# EAGLE design csa_viaproto-v1.0a (EAGLE 4.15)
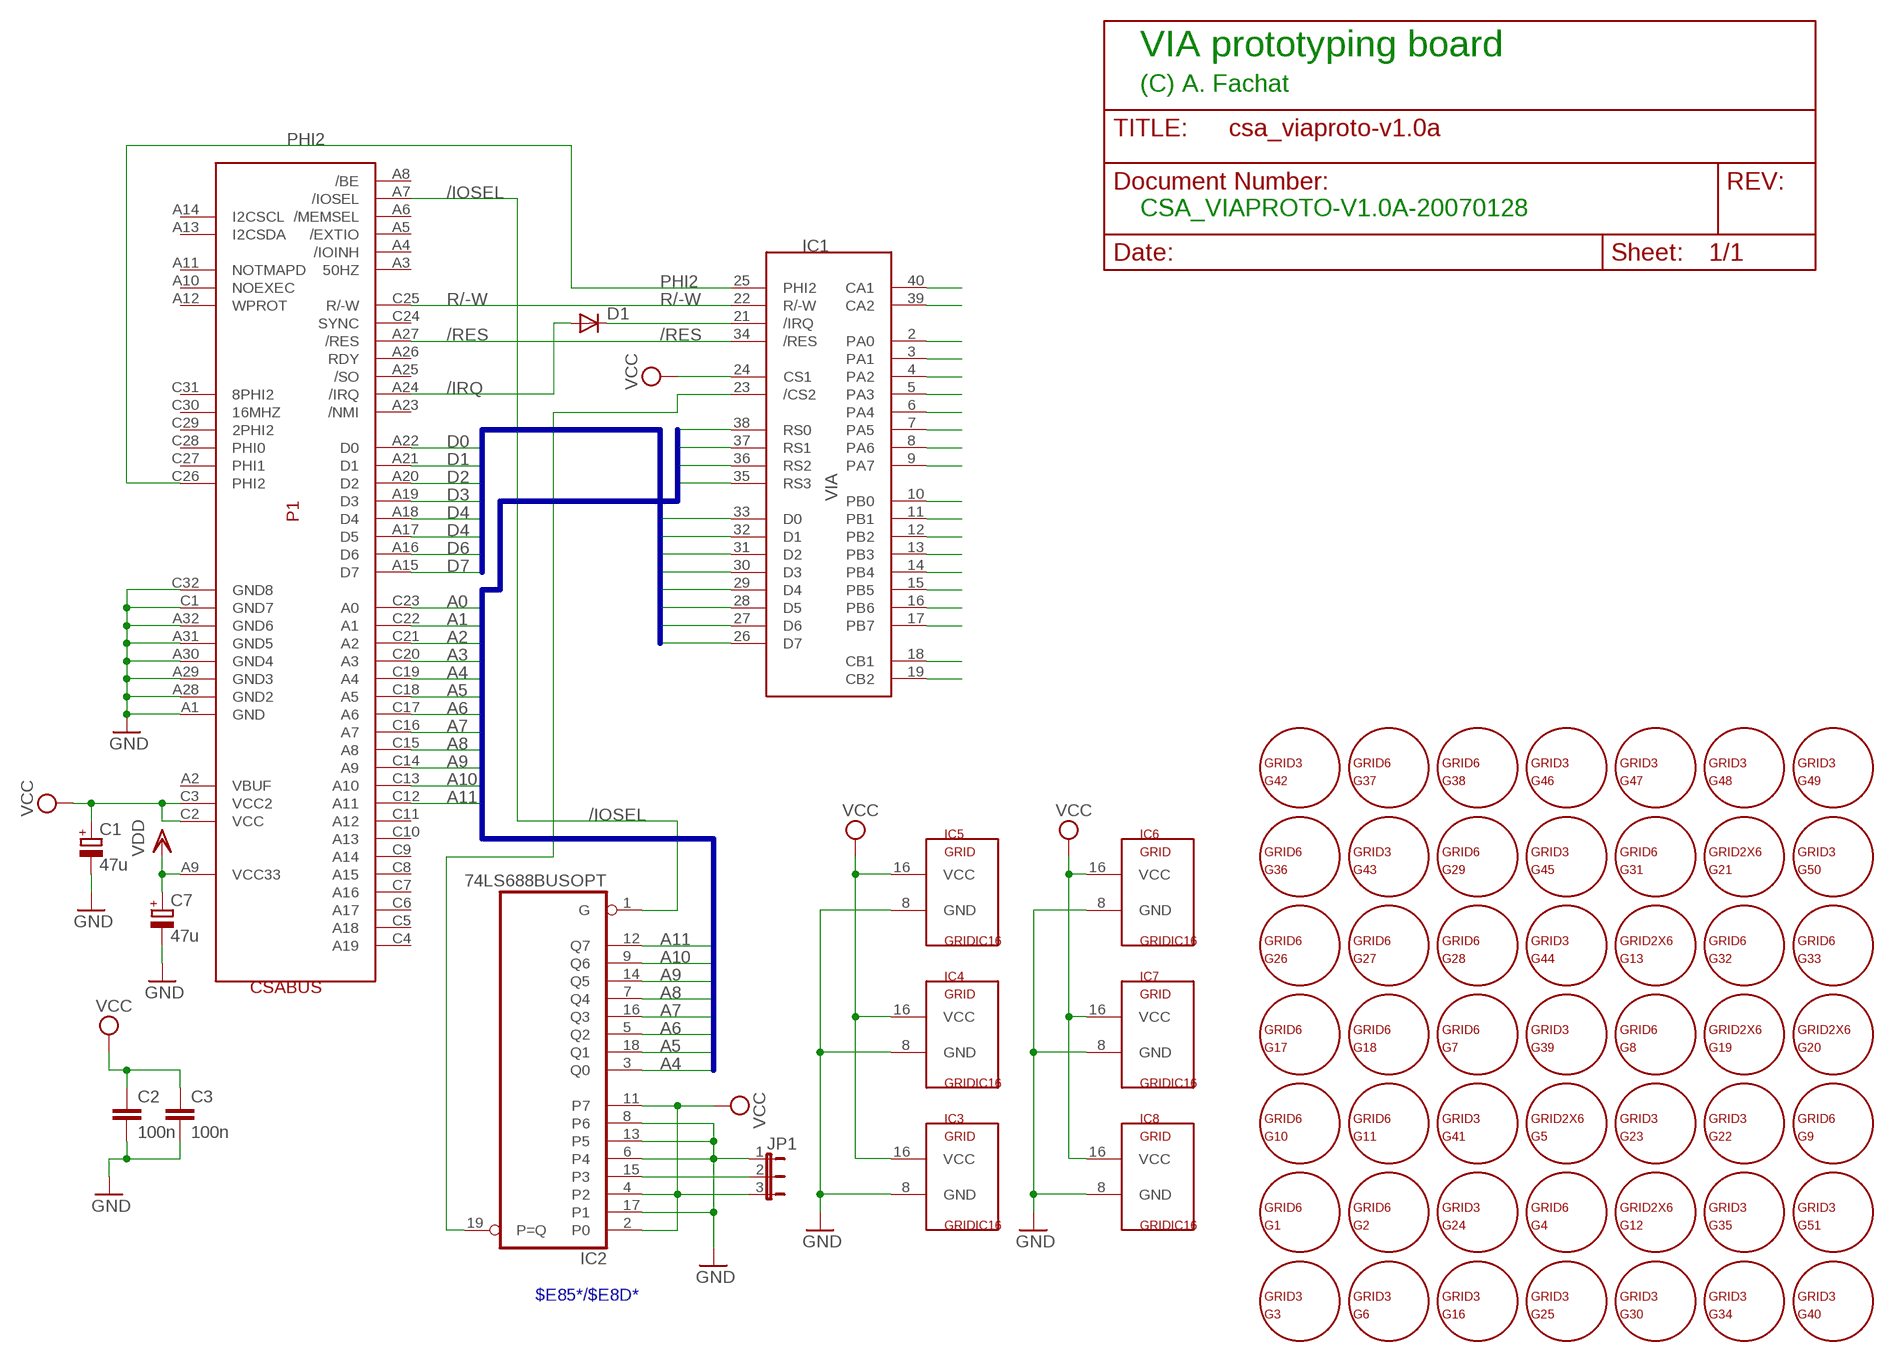
[diagram p0: schematic, sheet 1]

## Parts
C1  47u  CPOL-EUE2.5-5  [E2,5-5]
C2  100n  C-EU050-025X075  [C050-025X075]
C3  100n  C-EU050-025X075  [C050-025X075]
C7  47u  CPOL-EUE2.5-5  [E2,5-5]
D1  DIODE-D-5  [D-5]
G1  GRID6  [GRID6]
G2  GRID6  [GRID6]
G3  GRID3  [GRID3]
G4  GRID6  [GRID6]
G5  GRID2X6  [GRID2X6]
G6  GRID3  [GRID3]
G7  GRID6  [GRID6]
G8  GRID6  [GRID6]
G9  GRID6  [GRID6]
G10  GRID6  [GRID6]
G11  GRID6  [GRID6]
G12  GRID2X6  [GRID2X6]
G13  GRID2X6  [GRID2X6]
G16  GRID3  [GRID3]
G17  GRID6  [GRID6]
G18  GRID6  [GRID6]
G19  GRID2X6  [GRID2X6]
G20  GRID2X6  [GRID2X6]
G21  GRID2X6  [GRID2X6]
G22  GRID3  [GRID3]
G23  GRID3  [GRID3]
G24  GRID3  [GRID3]
G25  GRID3  [GRID3]
G26  GRID6  [GRID6]
G27  GRID6  [GRID6]
G28  GRID6  [GRID6]
G29  GRID6  [GRID6]
G30  GRID3  [GRID3]
G31  GRID6  [GRID6]
G32  GRID6  [GRID6]
G33  GRID6  [GRID6]
G34  GRID3  [GRID3]
G35  GRID3  [GRID3]
G36  GRID6  [GRID6]
G37  GRID6  [GRID6]
G38  GRID6  [GRID6]
G39  GRID3  [GRID3]
G40  GRID3  [GRID3]
G41  GRID3  [GRID3]
G42  GRID3  [GRID3]
G43  GRID3  [GRID3]
G44  GRID3  [GRID3]
G45  GRID3  [GRID3]
G46  GRID3  [GRID3]
G47  GRID3  [GRID3]
G48  GRID3  [GRID3]
G49  GRID3  [GRID3]
G50  GRID3  [GRID3]
G51  GRID3  [GRID3]
IC1  VIA  [DIL40]
IC2  74LS688BUSOPT  [DIL20]
IC3  GRIDIC16  [GRIDIC8]
IC4  GRIDIC16  [GRIDIC8]
IC5  GRIDIC16  [GRIDIC8]
IC6  GRIDIC16  [GRIDIC8]
IC7  GRIDIC16  [GRIDIC8]
IC8  GRIDIC16  [GRIDIC8]
JP1  JP2E  [JP2]
P1  CSABUS  [CSABUS]

## Nets
/IOSEL: IC2.1(G) P1.A7(/IOSEL)
/IRQ: D1.A P1.A24(/IRQ)
/RES: IC1.34(/RES) P1.A27(/RES)
A0: IC1.38(RS0) P1.C23(A0)
A1: IC1.37(RS1) P1.C22(A1)
A2: IC1.36(RS2) P1.C21(A2)
A3: IC1.35(RS3) P1.C20(A3)
A4: IC2.3(Q0) P1.C19(A4)
A5: IC2.18(Q1) P1.C18(A5)
A6: IC2.5(Q2) P1.C17(A6)
A7: IC2.16(Q3) P1.C16(A7)
A8: IC2.7(Q4) P1.C15(A8)
A9: IC2.14(Q5) P1.C14(A9)
A10: IC2.9(Q6) P1.C13(A10)
A11: IC2.12(Q7) P1.C12(A11)
D0: IC1.33(D0) P1.A22(D0)
D1: IC1.32(D1) P1.A21(D1)
D2: IC1.31(D2) P1.A20(D2)
D3: IC1.30(D3) P1.A19(D3)
D4: IC1.29(D4) P1.A17(D5) P1.A18(D4)
D5: IC1.28(D5)
D6: IC1.27(D6) P1.A16(D6)
D7: IC1.26(D7) P1.A15(D7)
GND: C1.- C2.2 C3.2 C7.- IC2.6(P4) IC2.8(P6) IC2.13(P5) IC2.17(P1) IC3.8(GND) IC4.8(GND) IC5.8(GND) IC6.8(GND) IC7.8(GND) IC8.8(GND) JP1.1 P1.A1(GND) P1.A28(GND2) P1.A29(GND3) P1.A30(GND4) P1.A31(GND5) P1.A32(GND6) P1.C1(GND7) P1.C32(GND8)
N$2: D1.C IC1.21(/IRQ)
N$7: IC1.23(/CS2) IC2.19(P=Q)
N$8: IC1.40(CA1)
N$9: IC1.39(CA2)
N$10: IC1.2(PA0)
N$11: IC1.3(PA1)
N$12: IC1.4(PA2)
N$13: IC1.5(PA3)
N$14: IC1.6(PA4)
N$15: IC1.7(PA5)
N$16: IC1.8(PA6)
N$17: IC1.9(PA7)
N$18: IC1.10(PB0)
N$19: IC1.11(PB1)
N$20: IC1.12(PB2)
N$21: IC1.13(PB3)
N$22: IC1.14(PB4)
N$23: IC1.15(PB5)
N$24: IC1.16(PB6)
N$25: IC1.17(PB7)
N$26: IC1.18(CB1)
N$27: IC1.19(CB2)
N$29: IC2.15(P3) JP1.2
PHI2: IC1.25(PHI2) P1.C26(PHI2)
R/-W: IC1.22(R/-W) P1.C25(R/-W)
VCC: C1.+ C2.1 C3.1 IC1.24(CS1) IC2.2(P0) IC2.4(P2) IC2.11(P7) IC3.16(VCC) IC4.16(VCC) IC5.16(VCC) IC6.16(VCC) IC7.16(VCC) IC8.16(VCC) JP1.3 P1.C2(VCC) P1.C3(VCC2)
VDD: C7.+ P1.A9(VCC33)
Unconnected: P1.A2(VBUF) P1.A3(50HZ) P1.A4(/IOINH) P1.A5(/EXTIO) P1.A6(/MEMSEL) P1.A8(/BE) P1.A10(NOEXEC) P1.A11(NOTMAPD) P1.A12(WPROT) P1.A13(I2CSDA) P1.A14(I2CSCL) P1.A23(/NMI) P1.A25(/SO) P1.A26(RDY) P1.C4(A19) P1.C5(A18) P1.C6(A17) P1.C7(A16) P1.C8(A15) P1.C9(A14) P1.C10(A13) P1.C11(A12) P1.C24(SYNC) P1.C27(PHI1) P1.C28(PHI0) P1.C29(2PHI2) P1.C30(16MHZ) P1.C31(8PHI2)

## Buses
D[0..7]
A[0..11]

## Notes on the sheet
- VIA prototyping board
- (C) A. Fachat
- CSA_VIAPROTO-V1.0A-20070128
- $E85*/$E8D*

## Power pins joined to a net without a drawn wire
GND: IC1.1(GND) IC2.10(GND)
VCC: IC1.20(VCC) IC2.20(VCC)

## Library data of the parts
C1 C7 = rcl:CPOL-EU: POLARIZED CAPACITOR, European symbol
C2 C3 = rcl:C-EU: CAPACITOR, European symbol
D1 = diode:DIODE-: DIODE
G1-G13 G16-G51 = csa:GRID
IC1 = csa:VIA
IC2 = csa:74LS688BUSOPT
IC3-IC8 = csa:GRIDIC
JP1 = jumper:JP2E: JUMPER
P1 = csa:CSABUS

## Board
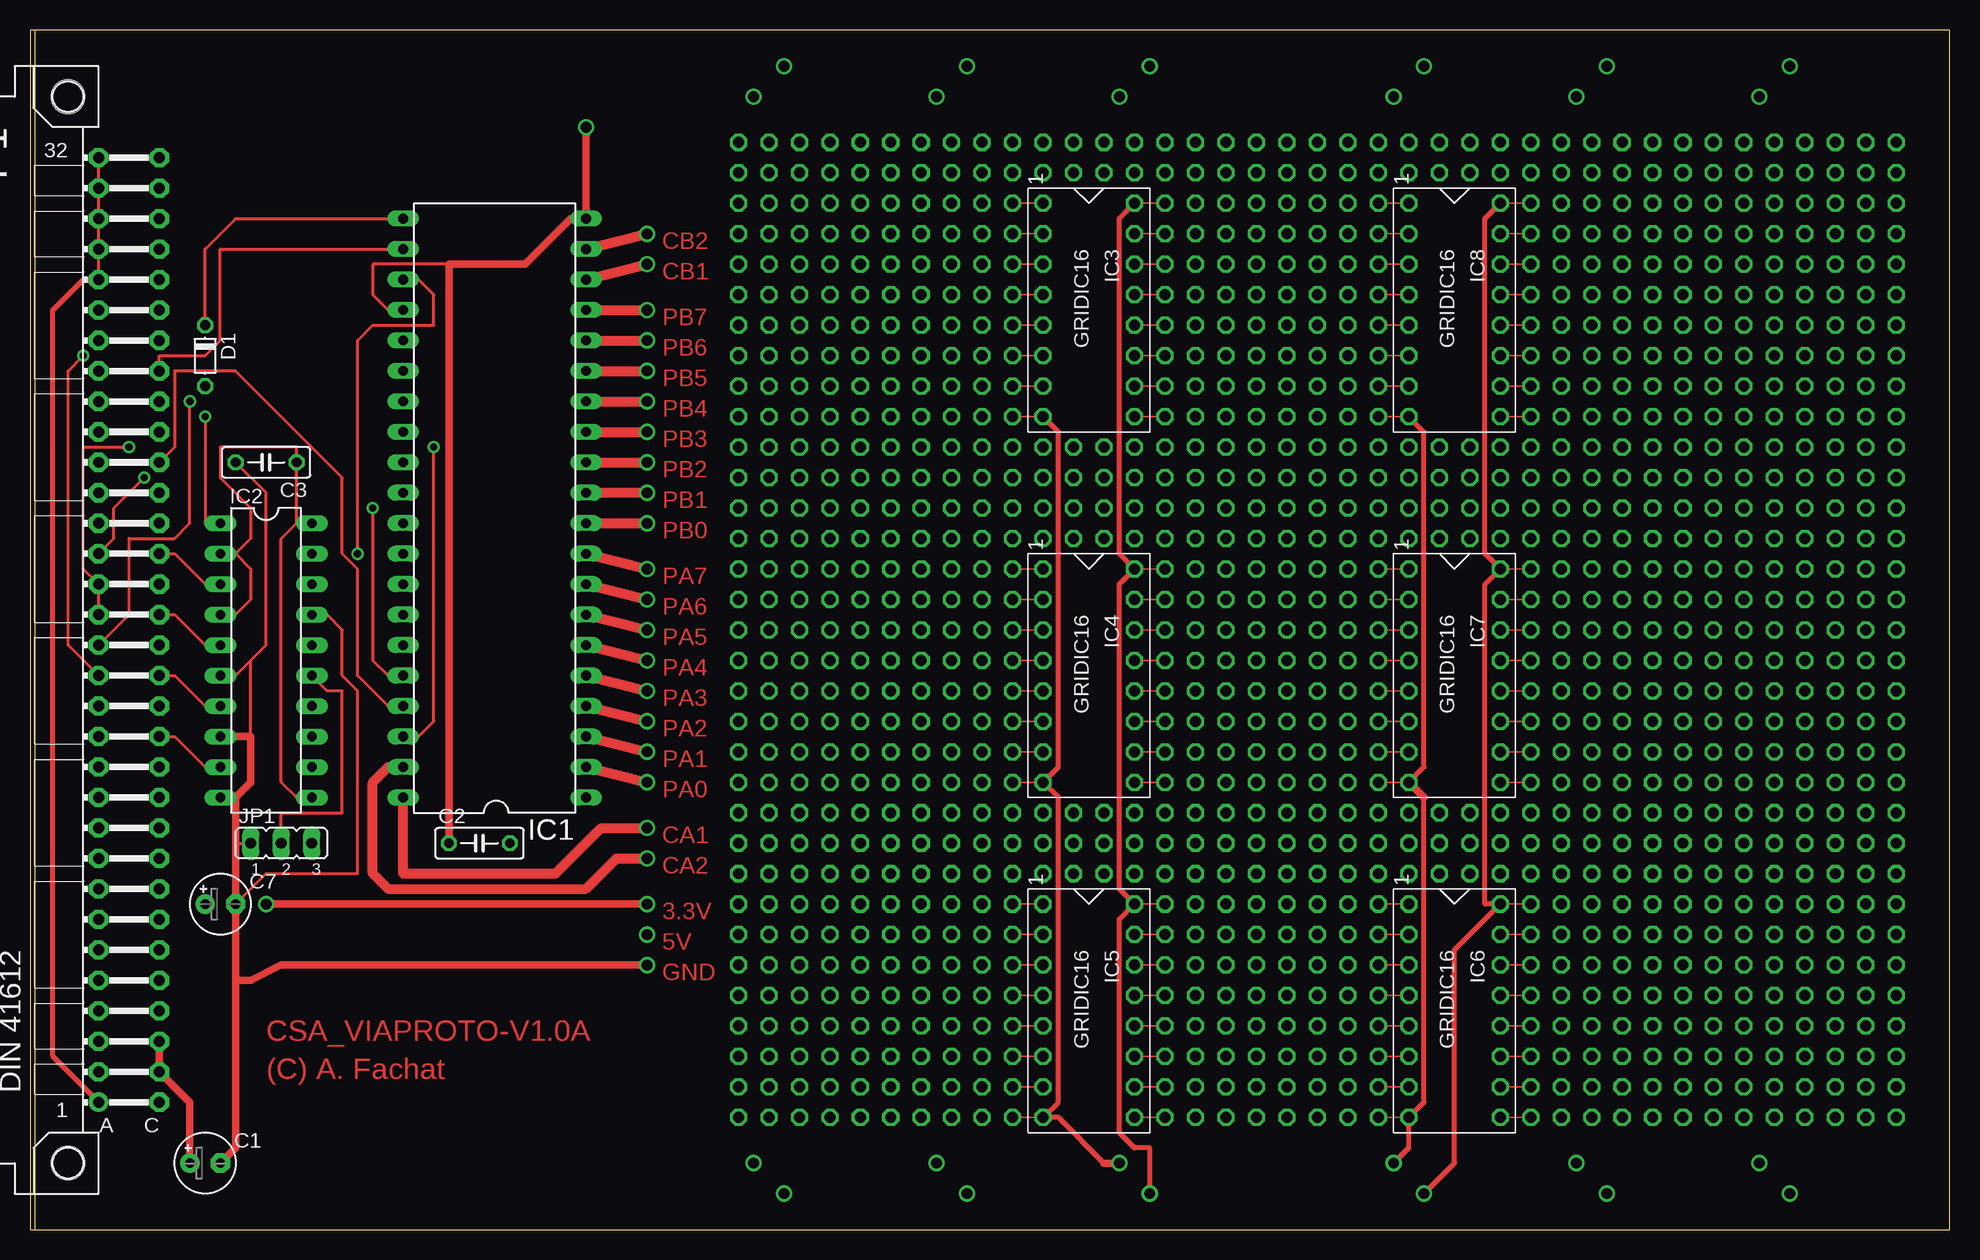
[diagram p1: board, top side]
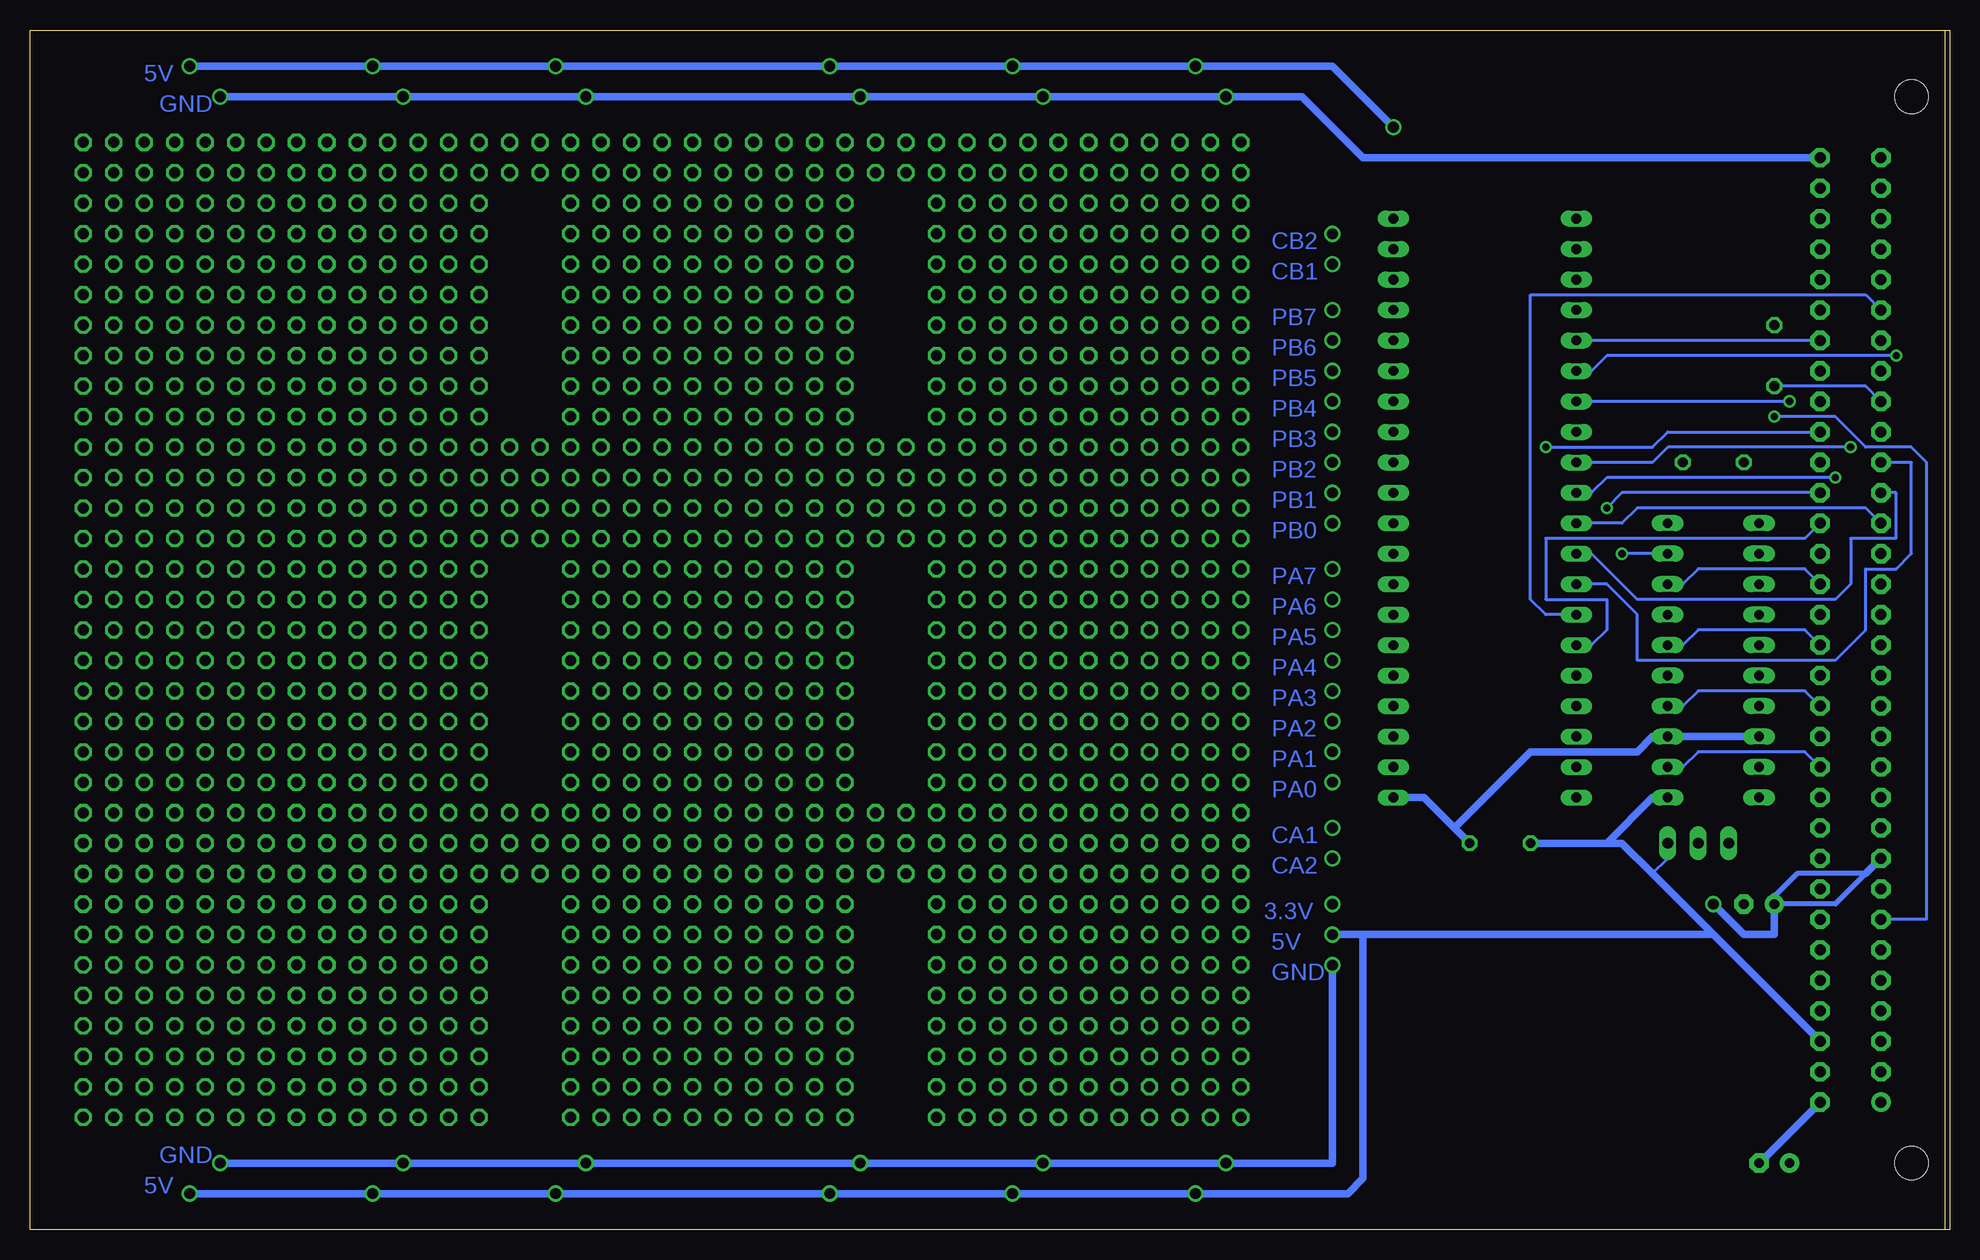
[diagram p2: board, bottom side, seen from below]

Size 160 x 100.03 mm. Coordinates in mm from the lower left corner, seen from the top.
Outline: 0,0.01 160,0.01 160,100.01 0,100.01 0,0.01
Copper layers (1*16): Top 0.035mm / dielectric 1.5mm / Bottom 0.035mm
Design rules "default": minimum track width 10mil, minimum drill 24mil, track to track 8mil, track to pad 8mil, pad to pad 8mil, via to via 8mil, smd to smd 8mil, copper to edge 40mil, drill to drill 8mil, minimum pad ring 10mil, minimum via ring 8mil, stop-mask expansion 4mil, vias tented up to drill 0mil, thermal gap 10mil

### Footprints (pad centres in the part's own frame; a part is rotated, then mirrored left to right if it is on the bottom)
E2,5-5 = drill 0.813 pad 1.6 round: + -1.27,0 | drill 0.813 pad 1.6 octagon: - 1.27,0
C050-025X075 = drill 0.813 octagon: 1 -2.54,0; 2 2.54,0
D-5 = drill 0.813 octagon: A 2.54,0; C -2.54,0
GRID6 = drill 0.914 octagon: 1 -6.35,-1.27; 2 -3.81,-1.27; 3 -1.27,-1.27; 4 1.27,-1.27; 5 3.81,-1.27; 6 6.35,-1.27; 7 -6.35,3.81; 8 -3.81,3.81; 9 -1.27,3.81; 10 1.27,3.81; 11 3.81,3.81; 12 6.35,3.81; 13 -6.35,-6.35; 14 -3.81,-6.35; 15 -1.27,-6.35; 16 1.27,-6.35; 17 3.81,-6.35; 18 6.35,-6.35; A -6.35,1.27; A1 -6.35,6.35; A2 -6.35,-3.81; B -3.81,1.27; B1 -3.81,6.35; B2 -3.81,-3.81; C -1.27,1.27; C1 -1.27,6.35; C2 -1.27,-3.81; D 1.27,1.27; D1 1.27,6.35; D2 1.27,-3.81; E 3.81,1.27; E1 3.81,6.35; E2 3.81,-3.81; F 6.35,1.27; F1 6.35,6.35; F2 6.35,-3.81
GRID3 = drill 0.914 octagon: 1 -2.54,2.54; 2 0,2.54; 3 2.54,2.54; 13 -2.54,-2.54; 14 0,-2.54; 15 2.54,-2.54; A2 -2.54,0; B2 0,0; C2 2.54,0
GRID2X6 = drill 0.914 octagon: 1 -1.27,-1.27; 2 1.27,-1.27; 3 -1.27,1.27; 7 -1.27,3.81; 8 1.27,3.81; 13 -1.27,-6.35; 14 1.27,-6.35; 15 1.27,1.27; A1 -1.27,6.35; A2 -1.27,-3.81; B1 1.27,6.35; B2 1.27,-3.81
DIL40 = drill 0.813 long: 1 -16.51,-7.62; 2 -13.97,-7.62; 3 -11.43,-7.62; 4 -8.89,-7.62; 5 -6.35,-7.62; 6 -3.81,-7.62; 7 -1.27,-7.62; 8 1.27,-7.62; 9 3.81,-7.62; 10 6.35,-7.62; 11 8.89,-7.62; 12 11.43,-7.62; 13 13.97,-7.62; 14 16.51,-7.62; 15 19.05,-7.62; 16 21.59,-7.62; 17 24.13,-7.62; 18 26.67,-7.62; 19 29.21,-7.62; 20 31.75,-7.62; 21 31.75,7.62; 22 29.21,7.62; 23 26.67,7.62; 24 24.13,7.62; 25 21.59,7.62; 26 19.05,7.62; 27 16.51,7.62; 28 13.97,7.62; 29 11.43,7.62; 30 8.89,7.62; 31 6.35,7.62; 32 3.81,7.62; 33 1.27,7.62; 34 -1.27,7.62; 35 -3.81,7.62; 36 -6.35,7.62; 37 -8.89,7.62; 38 -11.43,7.62; 39 -13.97,7.62; 40 -16.51,7.62
DIL20 = drill 0.813 long: 1 -10.16,-3.81; 2 -7.62,-3.81; 3 -5.08,-3.81; 4 -2.54,-3.81; 5 0,-3.81; 6 2.54,-3.81; 7 5.08,-3.81; 8 7.62,-3.81; 9 10.16,-3.81; 10 12.7,-3.81; 11 12.7,3.81; 12 10.16,3.81; 13 7.62,3.81; 14 5.08,3.81; 15 2.54,3.81; 16 0,3.81; 17 -2.54,3.81; 18 -5.08,3.81; 19 -7.62,3.81; 20 -10.16,3.81
GRIDIC8 = drill 0.914 octagon: 1 -8.89,-3.81; 2 -6.35,-3.81; 3 -3.81,-3.81; 4 -1.27,-3.81; 5 1.27,-3.81; 6 3.81,-3.81; 7 6.35,-3.81; 8 8.89,-3.81; 9 8.89,3.81; 10 6.35,3.81; 11 3.81,3.81; 12 1.27,3.81; 13 -1.27,3.81; 14 -3.81,3.81; 15 -6.35,3.81; 16 -8.89,3.81; X1 -8.89,-6.35; X2 -6.35,-6.35; X3 -3.81,-6.35; X4 -1.27,-6.35; X5 1.27,-6.35; X6 3.81,-6.35; X7 6.35,-6.35; X8 8.89,-6.35; X9 8.89,6.35; X10 6.35,6.35; X11 3.81,6.35; X12 1.27,6.35; X13 -1.27,6.35; X14 -3.81,6.35; X15 -6.35,6.35; X16 -8.89,6.35
JP2 = drill 0.914 long: 1 -2.54,0; 2 0,0; 3 2.54,0
CSABUS = drill 0.914 pad 1.6 round: A1 7.62,36.83 | drill 0.914 pad 1.6 octagon: A2 7.62,34.29; A3 7.62,31.75; A4 7.62,29.21; A5 7.62,26.67; A6 7.62,24.13; A7 7.62,21.59; A8 7.62,19.05; A9 7.62,16.51; A10 7.62,13.97; A11 7.62,11.43; A12 7.62,8.89; A13 7.62,6.35; A14 7.62,3.81; A15 7.62,1.27; A16 7.62,-1.27; A17 7.62,-3.81; A18 7.62,-6.35; A19 7.62,-8.89; A20 7.62,-11.43; A21 7.62,-13.97; A22 7.62,-16.51; A23 7.62,-19.05; A24 7.62,-21.59; A25 7.62,-24.13; A26 7.62,-26.67; A27 7.62,-29.21; A28 7.62,-31.75; A29 7.62,-34.29; A30 7.62,-36.83; A31 7.62,-39.37; A32 7.62,-41.91; C1 2.54,36.83; C2 2.54,34.29; C3 2.54,31.75; C4 2.54,29.21; C5 2.54,26.67; C6 2.54,24.13; C7 2.54,21.59; C8 2.54,19.05; C9 2.54,16.51; C10 2.54,13.97; C11 2.54,11.43; C12 2.54,8.89; C13 2.54,6.35; C14 2.54,3.81; C15 2.54,1.27; C16 2.54,-1.27; C17 2.54,-3.81; C18 2.54,-6.35; C19 2.54,-8.89; C20 2.54,-11.43; C21 2.54,-13.97; C22 2.54,-16.51; C23 2.54,-19.05; C24 2.54,-21.59; C25 2.54,-24.13; C26 2.54,-26.67; C27 2.54,-29.21; C28 2.54,-31.75; C29 2.54,-34.29; C30 2.54,-36.83; C31 2.54,-39.37; C32 2.54,-41.91 | hole 2.794: 10.16,41.91; 10.16,-46.99

### Placement (x,y rotation side)
C1  14.6,5.56 0 top
C2  37.46,32.23 0 top
C3  19.68,63.98 180 top
C7  15.87,27.15 0 top
D1  14.6,72.87 270 top
G1  149.22,38.58 0 top
G2  133.98,69.06 0 top
G3  153.03,11.91 0 top
G4  149.22,53.82 0 top
G5  118.74,58.9 90 top
G6  145.41,11.91 0 top
G7  133.98,23.34 0 top
G8  133.98,38.58 0 top
G9  133.98,53.82 0 top
G10  133.98,84.3 0 top
G11  149.22,69.06 0 top
G12  118.74,63.98 90 top
G13  118.74,89.38 90 top
G16  137.79,11.91 0 top
G17  149.22,23.34 0 top
G18  149.22,84.3 0 top
G19  88.26,58.9 270 top
G20  88.26,63.98 90 top
G21  88.26,89.38 90 top
G22  92.07,32.23 0 top
G23  84.45,32.23 0 top
G24  130.17,11.91 0 top
G25  122.55,32.23 0 top
G26  103.5,84.3 0 top
G27  103.5,53.82 0 top
G28  103.5,38.58 0 top
G29  103.5,23.34 0 top
G30  114.93,32.23 0 top
G31  103.5,69.06 0 top
G32  73.02,69.06 0 top
G33  73.02,38.58 0 top
G34  107.31,11.91 0 top
G35  99.69,11.91 0 top
G36  73.02,84.3 0 top
G37  73.02,53.82 0 top
G38  73.02,23.34 0 top
G39  76.83,11.91 0 top
G40  69.21,11.91 0 top
G41  61.59,88.11 0 top
G42  61.59,80.49 0 top
G43  61.59,72.87 0 top
G44  61.59,65.25 0 top
G45  61.59,57.63 0 top
G46  61.59,50.01 0 top
G47  61.59,42.39 0 top
G48  61.59,34.77 0 top
G49  61.59,27.15 0 top
G50  61.59,19.53 0 top
G51  61.59,11.91 0 top
IC1  38.73,52.55 90 top
IC2  19.68,48.74 270 top
IC3  88.26,76.68 270 top
IC4  88.26,46.2 270 top
IC5  88.26,18.26 270 top
IC6  118.74,18.26 270 top
IC7  118.74,46.2 270 top
IC8  118.74,76.68 270 top
JP1  20.95,32.23 0 top
P1  13.33,47.47 180 top

### Tracks (layer width: path | path; a pad name or v marks a point on that pad's centre or on a via)
/IOSEL  (via drill 0.61)
  Top 0.254: v14.6,67.79 14.6,58.9 IC2.1
  Bottom 0.254: v14.6,67.79 9.52,67.79 6.98,65.25 3.17,65.25 1.9,63.98 1.9,25.88 P1.A7
/IRQ
  Bottom 0.254: D1.A 6.98,70.33 P1.A24
/RES
  Bottom 0.254: P1.A27 6.98,77.95 34.92,77.95 34.92,52.55 33.65,51.28 IC1.34
A0  (via drill 0.61)
  Top 0.254: v33.65,65.25 33.65,42.39 32.38,41.12 IC1.38
  Bottom 0.254: v33.65,65.25 24.76,65.25 23.49,66.52 P1.C23
A1
  Top 0.254: P1.C22 12.06,65.25 12.06,71.6 17.14,71.6 26.03,62.71 26.03,56.36 27.3,55.09 27.3,46.2 29.84,43.66 IC1.37
A2  (via drill 0.61)
  Top 0.254: v28.57,60.17 28.57,47.47 29.84,46.2 IC1.36
  Bottom 0.254: v28.57,60.17 27.3,61.44 P1.C21
A3
  Bottom 0.254: P1.C20 12.06,57.63 33.65,57.63 33.65,52.55 28.57,52.55 28.57,50.01 29.84,48.74 IC1.35
A4
  Top 0.254: P1.C19 12.06,56.36 14.6,53.82 IC2.3
A5
  Bottom 0.254: P1.C18 12.06,55.09 20.95,55.09 22.22,53.82 IC2.18
A6
  Top 0.254: P1.C17 12.06,51.28 14.6,48.74 IC2.5
A7
  Bottom 0.254: P1.C16 12.06,50.01 20.95,50.01 22.22,48.74 IC2.16
A8
  Top 0.254: P1.C15 12.06,46.2 14.6,43.66 IC2.7
A9
  Bottom 0.254: P1.C14 12.06,44.93 20.95,44.93 22.22,43.66 IC2.14
A10
  Top 0.254: P1.C13 12.06,41.12 14.6,38.58 IC2.9
A11
  Bottom 0.254: P1.C12 12.06,39.85 20.95,39.85 22.22,38.58 IC2.12
D0
  Bottom 0.254: P1.A22 3.17,63.98 3.17,56.36 4.44,55.09 6.98,55.09 6.98,50.01 9.52,47.47 26.03,47.47 26.03,51.28 28.57,53.82 IC1.33
D1
  Bottom 0.254: P1.A21 4.44,61.44 4.44,57.63 8.25,57.63 8.25,53.82 9.52,52.55 26.03,52.55 29.84,56.36 IC1.32
D2
  Bottom 0.254: P1.A20 6.98,60.17 26.03,60.17 27.3,58.9 IC1.31
D3  (via drill 0.61)
  Top 0.254: v9.52,62.71 6.98,60.17 6.98,57.63 P1.A19
  Bottom 0.254: v9.52,62.71 28.57,62.71 29.84,61.44 IC1.30
D4  (via drill 0.61)
  Top 0.254: v8.25,65.25 4.44,65.25 4.44,55.09 P1.A18 P1.A17
  Bottom 0.254: v8.25,65.25 23.49,65.25 24.76,63.98 IC1.29
D6  (via drill 0.61)
  Top 0.254: v13.33,69.06 13.33,58.9 12.06,57.63 8.25,57.63 8.25,51.28 P1.A16
  Bottom 0.254: v13.33,69.06 IC1.27
D7  (via drill 0.61)
  Top 0.254: v4.44,72.87 3.17,71.6 3.17,48.74 P1.A15
  Bottom 0.254: v4.44,72.87 28.57,72.87 29.84,71.6 IC1.26
GND  (via drill 0.9)
  Top 0.254: P1.A28 P1.A29 P1.A30 P1.A31 P1.A32 P1.C32 | P1.A1 P1.C1 | C3.2 19.68,61.44 19.68,48.74 18.41,47.47 | 18.41,47.47 17.14,46.2 IC2.6 | IC2.17 24.76,51.28 26.03,50.01 26.03,46.2 27.3,44.93 27.3,29.69 19.68,29.69 C7.- | 18.41,41.12 18.41,47.47 | 17.14,32.23 JP1.1
  Top 0.406: IC3.8 85.72,66.52 85.72,38.58 IC4.8 85.72,36.04 85.72,10.64 IC5.8 85.72,9.37 89.53,5.56 | v113.66,5.56 114.93,6.83 IC6.8 116.2,10.64 116.2,36.04 | IC8.8 116.2,66.52 116.2,38.58 IC7.8 | P1.A28 4.44,79.22 1.9,76.68 1.9,14.45 P1.A1
  Top 0.61: 17.14,36.04 17.14,32.23 C7.- 17.14,20.8 | IC2.8 18.41,41.12 18.41,37.31 17.14,36.04 | 17.14,36.04 IC2.10 | C1.- 17.14,6.83 17.14,20.8 | 17.14,20.8 18.41,20.8 20.95,22.07 v51.43,22.07 | 116.2,36.04 IC7.8 | v90.8,5.56 89.53,5.56
  Bottom 0.254: IC2.13 24.76,41.12
  Bottom 0.61: P1.C1 C1.- | 41.27,33.5 43.81,36.04 IC1.1 | 41.27,33.5 C2.2 | IC2.8 IC2.13 | 41.27,33.5 34.92,39.85 26.03,39.85 24.76,41.12 | v51.43,22.07 51.43,5.56 v60.32,5.56 v75.56,5.56 v90.8,5.56 v113.66,5.56 v128.9,5.56 v144.14,5.56 | P1.C32 48.89,89.38 53.97,94.46 v60.32,94.46 v75.56,94.46 v90.8,94.46 v113.66,94.46 v128.9,94.46 v144.14,94.46
N$2
  Top 0.254: D1.C 14.6,81.76 17.14,84.3 IC1.21
N$7  (via drill 0.61)
  Top 0.254: v27.3,56.36 27.3,74.14 28.57,75.41 33.65,75.41 33.65,77.95 32.38,79.22 IC1.23
  Bottom 0.254: IC2.19 v27.3,56.36
N$8  (via drill 0.9)
  Top 0.813: IC1.40 31.11,29.69 43.81,29.69 47.62,33.5 v51.43,33.5
N$9  (via drill 0.9)
  Top 0.813: IC1.39 29.84,38.58 28.57,37.31 28.57,29.69 29.84,28.42 46.35,28.42 48.89,30.96 v51.43,30.96
N$10  (via drill 0.9)
  Top 0.813: IC1.2 v51.43,37.31
N$11  (via drill 0.9)
  Top 0.813: IC1.3 v51.43,39.85
N$12  (via drill 0.9)
  Top 0.813: IC1.4 v51.43,42.39
N$13  (via drill 0.9)
  Top 0.813: IC1.5 v51.43,44.93
N$14  (via drill 0.9)
  Top 0.813: IC1.6 v51.43,47.47
N$15  (via drill 0.9)
  Top 0.813: IC1.7 v51.43,50.01
N$16  (via drill 0.9)
  Top 0.813: IC1.8 v51.43,52.55
N$17  (via drill 0.9)
  Top 0.813: IC1.9 v51.43,55.09
N$18  (via drill 0.9)
  Top 0.813: IC1.10 v51.43,58.9
N$19  (via drill 0.9)
  Top 0.813: IC1.11 v51.43,61.44
N$20  (via drill 0.9)
  Top 0.813: IC1.12 v51.43,63.98
N$21  (via drill 0.9)
  Top 0.813: IC1.13 v51.43,66.52
N$22  (via drill 0.9)
  Top 0.813: IC1.14 v51.43,69.06
N$23  (via drill 0.9)
  Top 0.813: IC1.15 v51.43,71.6
N$24  (via drill 0.9)
  Top 0.813: IC1.16 v51.43,74.14
N$25  (via drill 0.9)
  Top 0.813: IC1.17 v51.43,76.68
N$26  (via drill 0.9)
  Top 0.813: IC1.18 v51.43,80.49
N$27  (via drill 0.9)
  Top 0.813: IC1.19 v51.43,83.03
N$29
  Top 0.254: IC2.15 24.76,44.93 26.03,44.93 26.03,34.77 20.95,34.77 JP1.2
PHI2
  Bottom 0.254: P1.C26 IC1.25
R/-W
  Top 0.254: P1.C25 10.79,72.87 14.6,72.87 15.87,74.14 15.87,81.76 IC1.22
VCC  (via drill 0.9)
  Top 0.254: 34.92,80.49 28.57,80.49 28.57,77.95 29.84,76.68 IC1.24 | 17.14,56.36 18.41,55.09 18.41,52.55 17.14,51.28 IC2.4 | 22.22,58.9 C3.1 22.22,65.25 15.87,65.25 15.87,62.71 18.41,60.17 18.41,57.63 17.14,56.36 | 17.14,56.36 IC2.2 | 22.22,58.9 20.95,57.63 20.95,37.31 22.22,36.04 IC2.11 | 22.22,58.9 IC2.20
  Top 0.406: IC3.16 90.8,84.3 90.8,56.36 IC4.16 90.8,53.82 90.8,28.42 IC5.16 90.8,25.88 90.8,8.1 92.07,6.83 93.34,6.83 v93.34,3.02 | v116.2,3.02 118.74,5.56 118.74,23.34 IC6.16 121.28,27.15 121.28,53.82 IC7.16 121.28,56.36 121.28,84.3 IC8.16
  Top 0.61: P1.C3 P1.C2 13.33,10.64 C1.+ | C2.1 34.92,80.49 41.27,80.49 45.08,84.3 IC1.20 v46.35,91.92
  Bottom 0.254: 24.76,36.04 IC2.11 | 24.76,29.69 23.49,30.96 JP1.3
  Bottom 0.61: 28.57,32.23 24.76,36.04 | 28.57,32.23 C2.1 | P1.C3 19.68,24.61 | 19.68,24.61 24.76,29.69 27.3,32.23 28.57,32.23 | 19.68,24.61 48.89,24.61 | 48.89,24.61 v51.43,24.61 | 48.89,24.61 48.89,4.29 50.16,3.02 v62.86,3.02 v78.1,3.02 v93.34,3.02 v116.2,3.02 v131.44,3.02 v146.68,3.02 | v46.35,91.92 51.43,97 v62.86,97 v78.1,97 v93.34,97 v116.2,97 v131.44,97 v146.68,97
VDD  (via drill 0.9)
  Top 0.61: v19.68,27.15 v51.43,27.15
  Bottom 0.406: C7.+ 9.52,27.15 6.98,29.69 12.7,29.69 14.6,27.79
  Bottom 0.61: 6.98,29.69 P1.A9 | v19.68,27.15 17.14,24.61 14.6,24.61 C7.+ 14.6,27.79

### Text on the board
Top: CB2 | CB1 | PB7 | PB6 | PB5 | PB4 | PB3 | PB2 | PB1 | PB0 | PA7 | PA6 | PA5 | PA4 | PA3 | PA2 | PA1 | PA0 | CA1 | CA2 | 3.3V | 5V | GND | CSA_VIAPROTO-V1.0A | (C) A. Fachat
Bottom: 5V | GND | CB2 | CB1 | PB7 | PB6 | PB5 | PB4 | PB3 | PB2 | PB1 | PB0 | PA7 | PA6 | PA5 | PA4 | PA3 | PA2 | PA1 | PA0 | CA1 | CA2 | 3.3V | 5V | GND | GND | 5V